# Altium schematic sheet KA2_5.SchDoc
size 420 x 297 mm; SheetNumber: 5; SheetTotal: 6
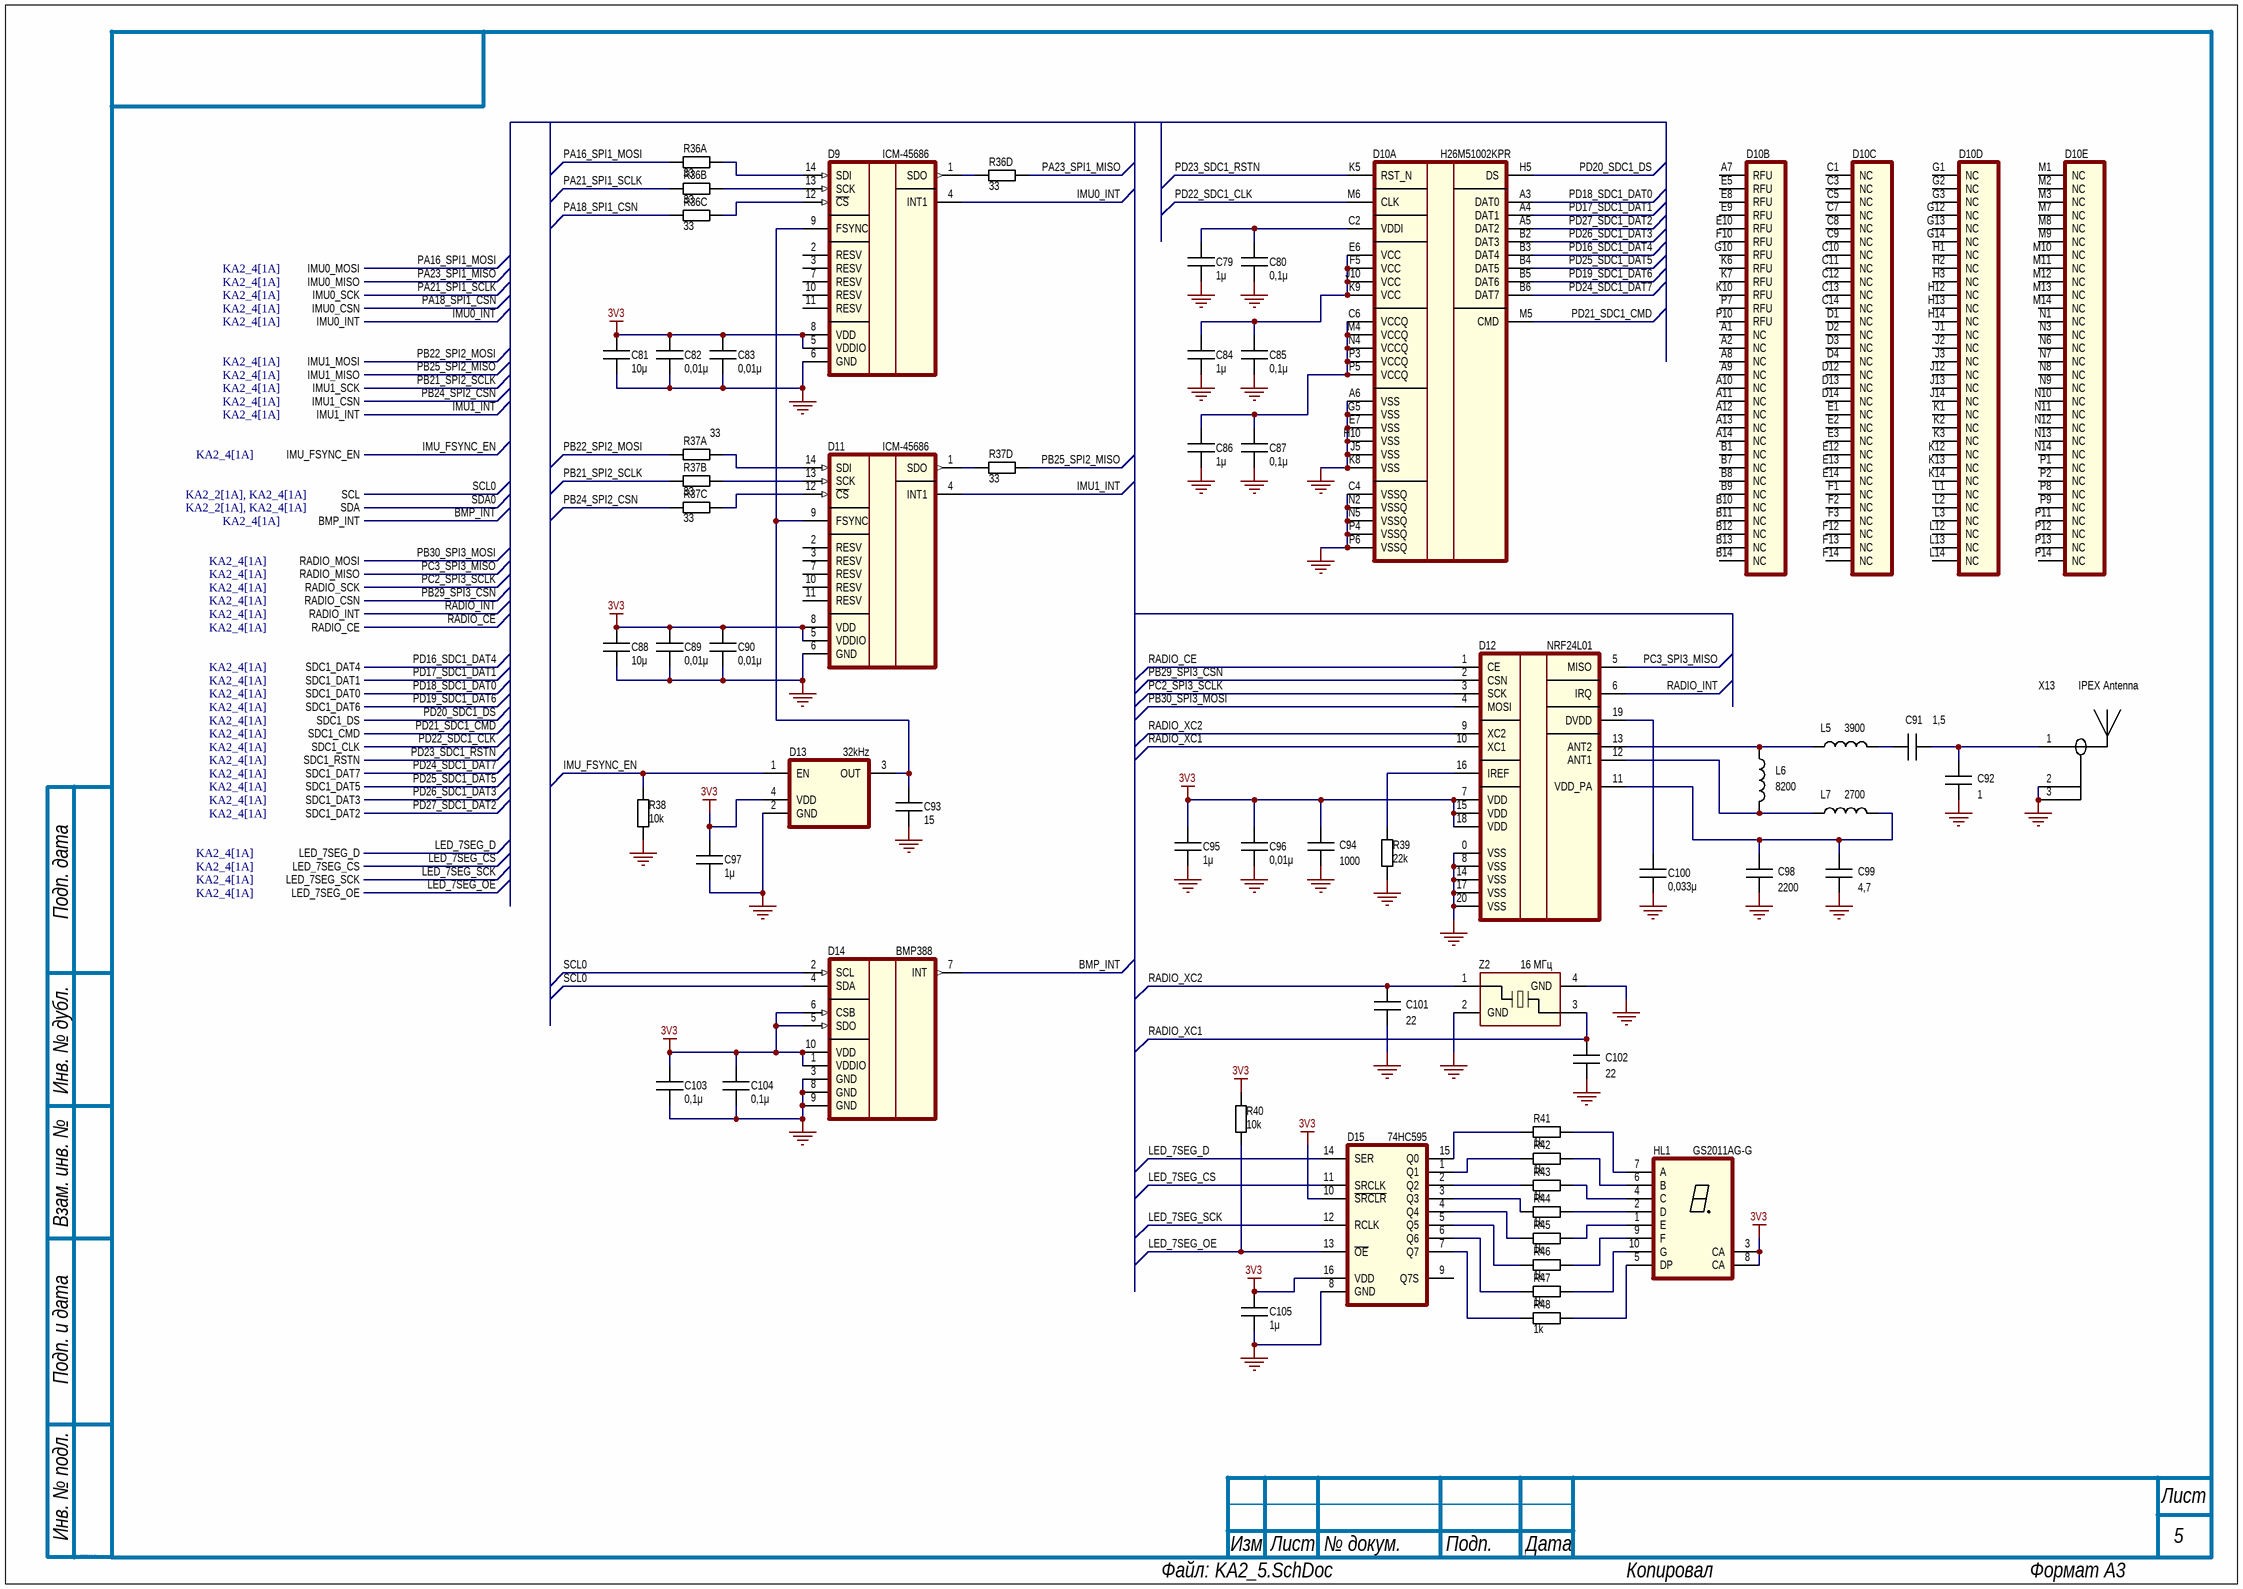
[diagram p0: KA2_5.SchDoc]

## Parts
C79  value 1μ  [Capacitor_0402]
C80  value 0,1μ  [Capacitor_0402]
C81  value 10μ  [Capacitor_0402]
C82  value 0,01μ  [Capacitor_0402]
C83  value 0,01μ  [Capacitor_0402]
C84  value 1μ  [Capacitor_0402]
C85  value 0,1μ  [Capacitor_0402]
C86  value 1μ  [Capacitor_0402]
C87  value 0,1μ  [Capacitor_0402]
C88  value 10μ  [Capacitor_0402]
C89  value 0,01μ  [Capacitor_0402]
C90  value 0,01μ  [Capacitor_0402]
C91  value 1,5  [Capacitor_0402]
C92  value 1  [Capacitor_0402]
C93  value 15  [Capacitor_0402]
C94  value 1000  [Capacitor_0402]
C95  value 1μ  [Capacitor_0402]
C96  value 0,01μ  [Capacitor_0402]
C97  value 1μ  [Capacitor_0402]
C98  value 2200  [Capacitor_0402]
C99  value 4,7  [Capacitor_0402]
C100  value 0,033μ  [Capacitor_0402]
C101  value 22  [Capacitor_0402]
C102  value 22  [Capacitor_0402]
C103  value 0,1μ  [Capacitor_0402]
C104  value 0,1μ  [Capacitor_0402]
C105  value 1μ  [Capacitor_0402]
D9  ICM-45686  [ICM-42688-P_LGA-14_3x2.5mm]
D10  value H26M51002KPR  [eMMC_13x11.5mm]  (hidden comment: 16GB eMMC 5.1 FBGA-153 Memory (ICs) RoHS)  (parts A,B,C,D,E of 5)
D11  ICM-45686  [ICM-42688-P_LGA-14_3x2.5mm]
D12  value NRF24L01  [QFN-20_4x4mm]  (hidden comment: NRF24L01P-R)
D13  value 32kHz  [OSC: 2016]  (hidden comment: OK7EL89CJI-111YLC-32.768K)
D14  BMP388  [BMP388_LGA-10_2x2mm]
D15  value 74HC595  [TSSOP-16]  (hidden comment: SN74HC595PWR)
HL1  GS2011AG-G  [LED_7SEG_SMD]
L5  value 3900  [IND: 0402]
L6  value 8200  [IND: 0402]
L7  value 2700  [IND: 0402]
R36  value 33  [RES: Array 4x0402]  (parts A,B,C,D of 4)
R37  value 33  [RES: Array 4x0402]  (parts A,B,C,D of 4)
R38  value 10k  [RES: 0402]
R39  value 22k  [RES: 0402]
R40  value 10k  [RES: 0402]
R41  value 1k  [RES: 0402]
R42  value 1k  [RES: 0402]
R43  value 1k  [RES: 0402]
R44  value 1k  [RES: 0402]
R45  value 1k  [RES: 0402]
R46  value 1k  [RES: 0402]
R47  value 1k  [RES: 0402]
R48  value 1k  [RES: 0402]
X13  value IPEX Antenna  [Conn_IPEX_ANTENNA]  (hidden comment: Connector Receptacle IPEX Male Pin 50Ω Surface Mount)
Z2  value 16 МГц  [OSC: 2016]  (hidden comment: Crystal 16MHz ±10ppm 12pF SMD2016-4P)

## Ports
BMP_INT (see KA2_4[1A]), IMU0_CSN (see KA2_4[1A]), IMU0_INT (see KA2_4[1A]), IMU0_MISO (see KA2_4[1A]), IMU0_MOSI (see KA2_4[1A]), IMU0_SCK (see KA2_4[1A]), IMU1_CSN (see KA2_4[1A]), IMU1_INT (see KA2_4[1A]), IMU1_MISO (see KA2_4[1A]), IMU1_MOSI (see KA2_4[1A]), IMU1_SCK (see KA2_4[1A]), IMU_FSYNC_EN (see KA2_4[1A]), LED_7SEG_CS (see KA2_4[1A]), LED_7SEG_D (see KA2_4[1A]), LED_7SEG_OE (see KA2_4[1A]), LED_7SEG_SCK (see KA2_4[1A]), RADIO_CE (see KA2_4[1A]), RADIO_CSN (see KA2_4[1A]), RADIO_INT (see KA2_4[1A]), RADIO_MISO (see KA2_4[1A]), RADIO_MOSI (see KA2_4[1A]), RADIO_SCK (see KA2_4[1A]), SCL (see KA2_2[1A], KA2_4[1A]), SDA (see KA2_2[1A], KA2_4[1A]), SDC1_CLK (see KA2_4[1A]), SDC1_CMD (see KA2_4[1A]), SDC1_DAT0 (see KA2_4[1A]), SDC1_DAT1 (see KA2_4[1A]), SDC1_DAT2 (see KA2_4[1A]), SDC1_DAT3 (see KA2_4[1A]), SDC1_DAT4 (see KA2_4[1A]), SDC1_DAT5 (see KA2_4[1A]), SDC1_DAT6 (see KA2_4[1A]), SDC1_DAT7 (see KA2_4[1A]), SDC1_DS (see KA2_4[1A]), SDC1_RSTN (see KA2_4[1A])

## Nets
3V3: C81.2 C82.2 C83.2 C88.2 C89.2 C90.2 C94.1 C95.2 C96.2 C97.2 C103.2 C104.2 C105.2 D9.5(VDDIO) D9.8(VDD) D11.5(VDDIO) D11.8(VDD) D12.7(VDD) D12.15(VDD) D12.18(VDD) D13.4(VDD) D14.1(VDDIO) D14.5(SDO) D14.6(CSB) D14.10(VDD) D15.10(~{SRCLR}) D15.16(VDD) HL1.3(CA) HL1.8(CA) R40.2
GND: C79.1 C80.1 C81.1 C82.1 C83.1 C84.1 C85.1 C86.1 C87.1 C88.1 C89.1 C90.1 C92.2 C93.1 C94.2 C95.1 C96.1 C97.1 C98.2 C99.2 C100.1 C101.2 C102.2 C103.1 C104.1 C105.1 D9.6(GND) D10.A6(VSS) D10.C4(VSSQ) D10.E7(VSS) D10.G5(VSS) D10.H10(VSS) D10.J5(VSS) D10.K8(VSS) D10.N2(VSSQ) D10.N5(VSSQ) D10.P4(VSSQ) D10.P6(VSSQ) D11.6(GND) D12.0(VSS) D12.8(VSS) D12.14(VSS) D12.17(VSS) D12.20(VSS) D13.2(GND) D14.3(GND) D14.8(GND) D14.9(GND) D15.8(GND) R38.1 R39.1 X13.2(GND) X13.3(GND) Z2.2(GND) Z2.4(GND)
BMP_INT: D14.7(INT) ; port BMP_INT
IMU0_INT: D9.4(INT1) ; port IMU0_INT
IMU1_INT: D11.4(INT1) ; port IMU1_INT
IMU_FSYNC_EN: D13.1(EN) R38.2 ; port IMU_FSYNC_EN
LED_7SEG_CS: D15.11(SRCLK) ; port LED_7SEG_CS
LED_7SEG_D: D15.14(SER) ; port LED_7SEG_D
LED_7SEG_OE: D15.13(~{OE}) R40.1 ; port LED_7SEG_OE
LED_7SEG_SCK: D15.12(RCLK) ; port LED_7SEG_SCK
PA16_SPI1_MOSI: R36.1 ; port IMU0_MOSI
PA18_SPI1_CSN: R36.3 ; port IMU0_CSN
PA21_SPI1_SCLK: R36.2 ; port IMU0_SCK
PA23_SPI1_MISO: R36.5 ; port IMU0_MISO
PB21_SPI2_SCLK: R37.2 ; port IMU1_SCK
PB22_SPI2_MOSI: R37.1 ; port IMU1_MOSI
PB24_SPI2_CSN: R37.3 ; port IMU1_CSN
PB25_SPI2_MISO: R37.5 ; port IMU1_MISO
PB29_SPI3_CSN: D12.2(CSN) ; port RADIO_CSN
PB30_SPI3_MOSI: D12.4(MOSI) ; port RADIO_MOSI
PC2_SPI3_SCLK: D12.3(SCK) ; port RADIO_SCK
PC3_SPI3_MISO: D12.5(MISO) ; port RADIO_MISO
PD16_SDC1_DAT4: D10.B3(DAT4) ; port SDC1_DAT4
PD17_SDC1_DAT1: D10.A4(DAT1) ; port SDC1_DAT1
PD18_SDC1_DAT0: D10.A3(DAT0) ; port SDC1_DAT0
PD19_SDC1_DAT6: D10.B5(DAT6) ; port SDC1_DAT6
PD20_SDC1_DS: D10.H5(DS) ; port SDC1_DS
PD21_SDC1_CMD: D10.M5(CMD) ; port SDC1_CMD
PD22_SDC1_CLK: D10.M6(CLK) ; port SDC1_CLK
PD23_SDC1_RSTN: D10.K5(RST_N) ; port SDC1_RSTN
PD24_SDC1_DAT7: D10.B6(DAT7) ; port SDC1_DAT7
PD25_SDC1_DAT5: D10.B4(DAT5) ; port SDC1_DAT5
PD26_SDC1_DAT3: D10.B2(DAT3) ; port SDC1_DAT3
PD27_SDC1_DAT2: D10.A5(DAT2) ; port SDC1_DAT2
RADIO_CE: D12.1(CE) ; port RADIO_CE
RADIO_INT: D12.6(IRQ) ; port RADIO_INT
RADIO_XC1: C102.1 D12.10(XC1) Z2.3(X2)
RADIO_XC2: C101.1 D12.9(XC2) Z2.1(X1)
SCL0: D14.2(SCL) D14.4(SDA) ; port SCL
SDA0: port SDA
NetC79_2: C79.2 C80.2 D10.C2(VDDI)
NetC84_2: C84.2 C85.2 D10.E6(VCC) D10.F5(VCC) D10.J10(VCC) D10.K9(VCC)
NetC86_2: C86.2 C87.2 D10.C6(VCCQ) D10.M4(VCCQ) D10.N4(VCCQ) D10.P3(VCCQ) D10.P5(VCCQ)
NetC91_1: C91.1 C92.1 X13.1(Antenna)
NetC91_2: C91.2 L5.1
NetC93_2: C93.2 D9.9(FSYNC) D11.9(FSYNC) D13.3(OUT)
NetC98_1: C98.1 C99.1 D12.11(VDD_PA) L7.1
NetC100_2: C100.2 D12.19(DVDD)
NetD9_1: D9.1(SDO) R36.4
NetD9_12: D9.12(~{CS}) R36.6
NetD9_13: D9.13(SCK) R36.7
NetD9_14: D9.14(SDI) R36.8
NetD11_1: D11.1(SDO) R37.4
NetD11_12: D11.12(~{CS}) R37.6
NetD11_13: D11.13(SCK) R37.7
NetD11_14: D11.14(SDI) R37.8
NetD12_12: D12.12(ANT1) L6.1 L7.2
NetD12_13: D12.13(ANT2) L5.2 L6.2
NetD12_16: D12.16(IREF) R39.2
NetD15_1: D15.1(Q1) R42.2
NetD15_2: D15.2(Q2) R43.2
NetD15_3: D15.3(Q3) R44.2
NetD15_4: D15.4(Q4) R45.2
NetD15_5: D15.5(Q5) R46.2
NetD15_6: D15.6(Q6) R47.2
NetD15_7: D15.7(Q7) R48.2
NetD15_15: D15.15(Q0) R41.2
NetHL1_1: HL1.1(E) R45.1
NetHL1_2: HL1.2(D) R44.1
NetHL1_4: HL1.4(C) R43.1
NetHL1_5: HL1.5(DP) R48.1
NetHL1_6: HL1.6(B) R42.1
NetHL1_7: HL1.7(A) R41.1
NetHL1_9: HL1.9(F) R46.1
NetHL1_10: HL1.10(G) R47.1

Not connected (* = marked no-connect by the designer): D9 2(RESV) 3(RESV) 7(RESV) 10(RESV) 11(RESV); D10 A1(NC) A2(NC) A7(RFU) A8(NC) A9(NC) A10(NC) A11(NC) A12(NC) A13(NC) A14(NC) B1(NC) B7(NC) B8(NC) B9(NC) B10(NC) B11(NC) B12(NC) B13(NC) B14(NC) C1(NC) C3(NC) C5(NC) C7(NC) C8(NC) C9(NC) C10(NC) C11(NC) C12(NC) C13(NC) C14(NC) D1(NC) D2(NC) D3(NC) D4(NC) D12(NC) D13(NC) D14(NC) E1(NC) E2(NC) E3(NC) E5(RFU) E8(RFU) E9(RFU) E10(RFU) E12(NC) E13(NC) E14(NC) F1(NC) F2(NC) F3(NC) F10(RFU) F12(NC) F13(NC) F14(NC) G1(NC) G2(NC) G3(NC) G10(RFU) G12(NC) G13(NC) G14(NC) H1(NC) H2(NC) H3(NC) H12(NC) H13(NC) H14(NC) J1(NC) J2(NC) J3(NC) J12(NC) J13(NC) J14(NC) K1(NC) K2(NC) K3(NC) K6(RFU) K7(RFU) K10(RFU) K12(NC) K13(NC) K14(NC) L1(NC) L2(NC) L3(NC) L12(NC) L13(NC) L14(NC) M1(NC) M2(NC) M3(NC) M7(NC) M8(NC) M9(NC) M10(NC) M11(NC) M12(NC) M13(NC) M14(NC) N1(NC) N3(NC) N6(NC) N7(NC) N8(NC) N9(NC) N10(NC) N11(NC) N12(NC) N13(NC) N14(NC) P1(NC) P2(NC) P7(RFU) P8(NC) P9(NC) P10(RFU) P11(NC) P12(NC) P13(NC) P14(NC); D11 2(RESV) 3(RESV) 7(RESV) 10(RESV) 11(RESV); D15 9(Q7S)

## Notes on the sheet
- Подп. дата
- Инв. № дубл.
- Взам. инв. №
- Подп. и дата
- Инв. № подл.
- Изм.
- Лист
- № докум.
- Подп.
- Дата
- ALTIUM GOSTBOM2.0 KEV
- Файл:
- Копировал
- Формат А3

## Library data of the parts
C79 C84 C86 C95 C97 C105 = Ceramic_0402: ValueManufacturerPartNumber: Ceramic capacitor, 1μ, X7R, ±10%, 16V, 0402; TypeCapacitor: Ceramic capacitor; Tolerance: ±10%; TypeDielectric: X7R; Voltage: 16V; Manufacturer: *; HelpURL: *; Package: 0402; Mfr.Part: *
C80 C85 C87 C103 C104 = Ceramic_0402: ValueManufacturerPartNumber: Ceramic capacitor, 0,1μ, X7R, ±10%, 16V, 0402; TypeCapacitor: Ceramic capacitor; Tolerance: ±10%; TypeDielectric: X7R; Voltage: 16V; Manufacturer: *; HelpURL: *; Package: 0402; Mfr.Part: *
C81 C88 = Ceramic_0402: ValueManufacturerPartNumber: Ceramic capacitor, 10μ, X7R, ±10%, 16V, 0402; TypeCapacitor: Ceramic capacitor; Tolerance: ±10%; TypeDielectric: X7R; Voltage: 16V; Manufacturer: *; HelpURL: *; Package: 0402; Mfr.Part: *
C82 C83 C89 C90 C96 = Ceramic_0402: ValueManufacturerPartNumber: Ceramic capacitor, 0,01μ, X7R, ±10%, 16V, 0402; TypeCapacitor: Ceramic capacitor; Tolerance: ±10%; TypeDielectric: X7R; Voltage: 16V; Manufacturer: *; HelpURL: *; Package: 0402; Mfr.Part: *
C91 = Ceramic_0402: ValueManufacturerPartNumber: Ceramic capacitor, 1,5, X7R, ±10%, 16V, 0402; TypeCapacitor: Ceramic capacitor; Tolerance: ±10%; TypeDielectric: X7R; Voltage: 16V; Manufacturer: *; HelpURL: *; Package: 0402; Mfr.Part: *
C92 = Ceramic_0402: ValueManufacturerPartNumber: Ceramic capacitor, 1, X7R, ±10%, 16V, 0402; TypeCapacitor: Ceramic capacitor; Tolerance: ±10%; TypeDielectric: X7R; Voltage: 16V; Manufacturer: *; HelpURL: *; Package: 0402; Mfr.Part: *
C93 = Ceramic_0402: ValueManufacturerPartNumber: Ceramic capacitor, 15, X7R, ±10%, 16V, 0402; TypeCapacitor: Ceramic capacitor; Tolerance: ±10%; TypeDielectric: X7R; Voltage: 16V; Manufacturer: *; HelpURL: *; Package: 0402; Mfr.Part: *
C94 = Ceramic_0402: ValueManufacturerPartNumber: Ceramic capacitor, 1000, X7R, ±10%, 16V, 0402; TypeCapacitor: Ceramic capacitor; Tolerance: ±10%; TypeDielectric: X7R; Voltage: 16V; Manufacturer: *; HelpURL: *; Package: 0402; Mfr.Part: *
C98 = Ceramic_0402: ValueManufacturerPartNumber: Ceramic capacitor, 2200, X7R, ±10%, 16V, 0402; TypeCapacitor: Ceramic capacitor; Tolerance: ±10%; TypeDielectric: X7R; Voltage: 16V; Manufacturer: *; HelpURL: *; Package: 0402; Mfr.Part: *
C99 = Ceramic_0402: ValueManufacturerPartNumber: Ceramic capacitor, 4,7, X7R, ±10%, 16V, 0402; TypeCapacitor: Ceramic capacitor; Tolerance: ±10%; TypeDielectric: X7R; Voltage: 16V; Manufacturer: *; HelpURL: *; Package: 0402; Mfr.Part: *
C100 = Ceramic_0402: ValueManufacturerPartNumber: Ceramic capacitor, 0,033μ, X7R, ±10%, 16V, 0402; TypeCapacitor: Ceramic capacitor; Tolerance: ±10%; TypeDielectric: X7R; Voltage: 16V; Manufacturer: *; HelpURL: *; Package: 0402; Mfr.Part: *
C101 C102 = Ceramic_0402: ValueManufacturerPartNumber: Ceramic capacitor, 22, X7R, ±10%, 16V, 0402; TypeCapacitor: Ceramic capacitor; Tolerance: ±10%; TypeDielectric: X7R; Voltage: 16V; Manufacturer: *; HelpURL: *; Package: 0402; Mfr.Part: *
D9 D11 = ICM-45686: Микросхема интегрального гироскопа-акселерометра (IMU), LGA-14 3x2.5mm; Manufacturer: TDK InvenSense; Mfr.Part: ICM-45686; Value: ICM-45686; HelpURL: *
D10 = eMMC_H26M51002KPR: Микросхема eMMC, 16ГБ, FBGA-153 13x11.5mm; Manufacturer: HYNIX; Mfr.Part: H26M51002KPR; HelpURL: https://www.lcsc.com/product-detail/C3002775.html
D12 = NRF24L01P-R: Микросхема радио-приемопередатчика 2.4 ГГц, QFN-20 4x4mm; Manufacturer: Nordic Semicomductor; Mfr.Part: NRF24L01P-R; HelpURL: https://www.lcsc.com/product-detail/C8791.html
D13 = OK7EL89CJI-111YLC-32.768K: Кварцевый генератор 32,768 кГц, 2016, 10ppm; Manufacturer: YXC Crystal Oscillators; Mfr.Part: OK7EL89CJI-111YLC-32.768K; HelpURL: https://www.lcsc.com/product-detail/C7425462.html
D14 = BMP388: Микросхема интегрального барометра, LGA-10 2x2mm; Manufacturer: Bosch; Mfr.Part: BMP388; Value: BMP388; HelpURL: https://www.lcsc.com/product-detail/C779278.html
D15 = SN74HC595PWR: Микросхема восьмиразрядного сдвигового регистра; Manufacturer: Texas Instruments; Mfr.Part: SN74HC595PWR; HelpURL: https://www.lcsc.com/product-detail/C273642.html
HL1 = GS2011AG-G: Индикатор светодиодный семисегментный зеленый, SMD, 10x6.9 мм, общий анод; Manufacturer: Guangcai Display; Value: GS2011AG-G; Mfr.Part: GS2011AG-G; HelpURL: https://www.lcsc.com/product-detail/C22462633.html
L5 = Inductor_0402: ValueManufacturerPartNumber: Inductor, 3900, ±10%, 0402; Tolerance: ±10%; Manufacturer: *; Mfr.Part: *; Package: 0402; TypeInductor: Inductor; HelpURL: *
L6 = Inductor_0402: ValueManufacturerPartNumber: Inductor, 8200, ±10%, 0402; Tolerance: ±10%; Manufacturer: *; Mfr.Part: *; Package: 0402; TypeInductor: Inductor; HelpURL: *
L7 = Inductor_0402: ValueManufacturerPartNumber: Inductor, 2700, ±10%, 0402; Tolerance: ±10%; Manufacturer: *; Mfr.Part: *; Package: 0402; TypeInductor: Inductor; HelpURL: *
R36 R37 = ResistorArray_0402_4: ValueManufacturerPartNumber: Resistor array (4), 33, ±1%, 0402; TypeResistor: Resistor array (4); Tolerance: ±1%; Manufacturer: *; Mfr.Part: *; Package: 0402; HelpURL: *
R38 R40 = Resistor_0402: ValueManufacturerPartNumber: Resistor, 10k, ±1%, 0402; Tolerance: ±1%; Manufacturer: *; Package: 0402; Mfr.Part: *; TypeResistor: Resistor; HelpURL: *
R39 = Resistor_0402: ValueManufacturerPartNumber: Resistor, 22k, ±1%, 0402; Tolerance: ±1%; Manufacturer: *; Package: 0402; Mfr.Part: *; TypeResistor: Resistor; HelpURL: *
R41-R48 = Resistor_0402: ValueManufacturerPartNumber: Resistor, 1k, ±1%, 0402; Tolerance: ±1%; Manufacturer: *; Package: 0402; Mfr.Part: *; TypeResistor: Resistor; HelpURL: *
X13 = Antenna_IPEX: Manufacturer: HRS; Mfr.Part: U.FL-R-SMT-1(80); HelpURL: https://www.lcsc.com/product-detail/C88374.html
Z2 = Crystal_XL7EL89COI-111YLC-16M: Кварцевый резонатор 16 МГц 2016; Manufacturer: YXC Crystal Oscillators; Mfr.Part: XL7EL89COI-111YLC-16M; HelpURL: https://www.lcsc.com/product-detail/C2965579.html